# Altium schematic sheet Clocking.SchDoc: BaseBand Front-End
size A3; Revision: 1; SheetNumber: 5; ModifiedDate: 07.06.2011г
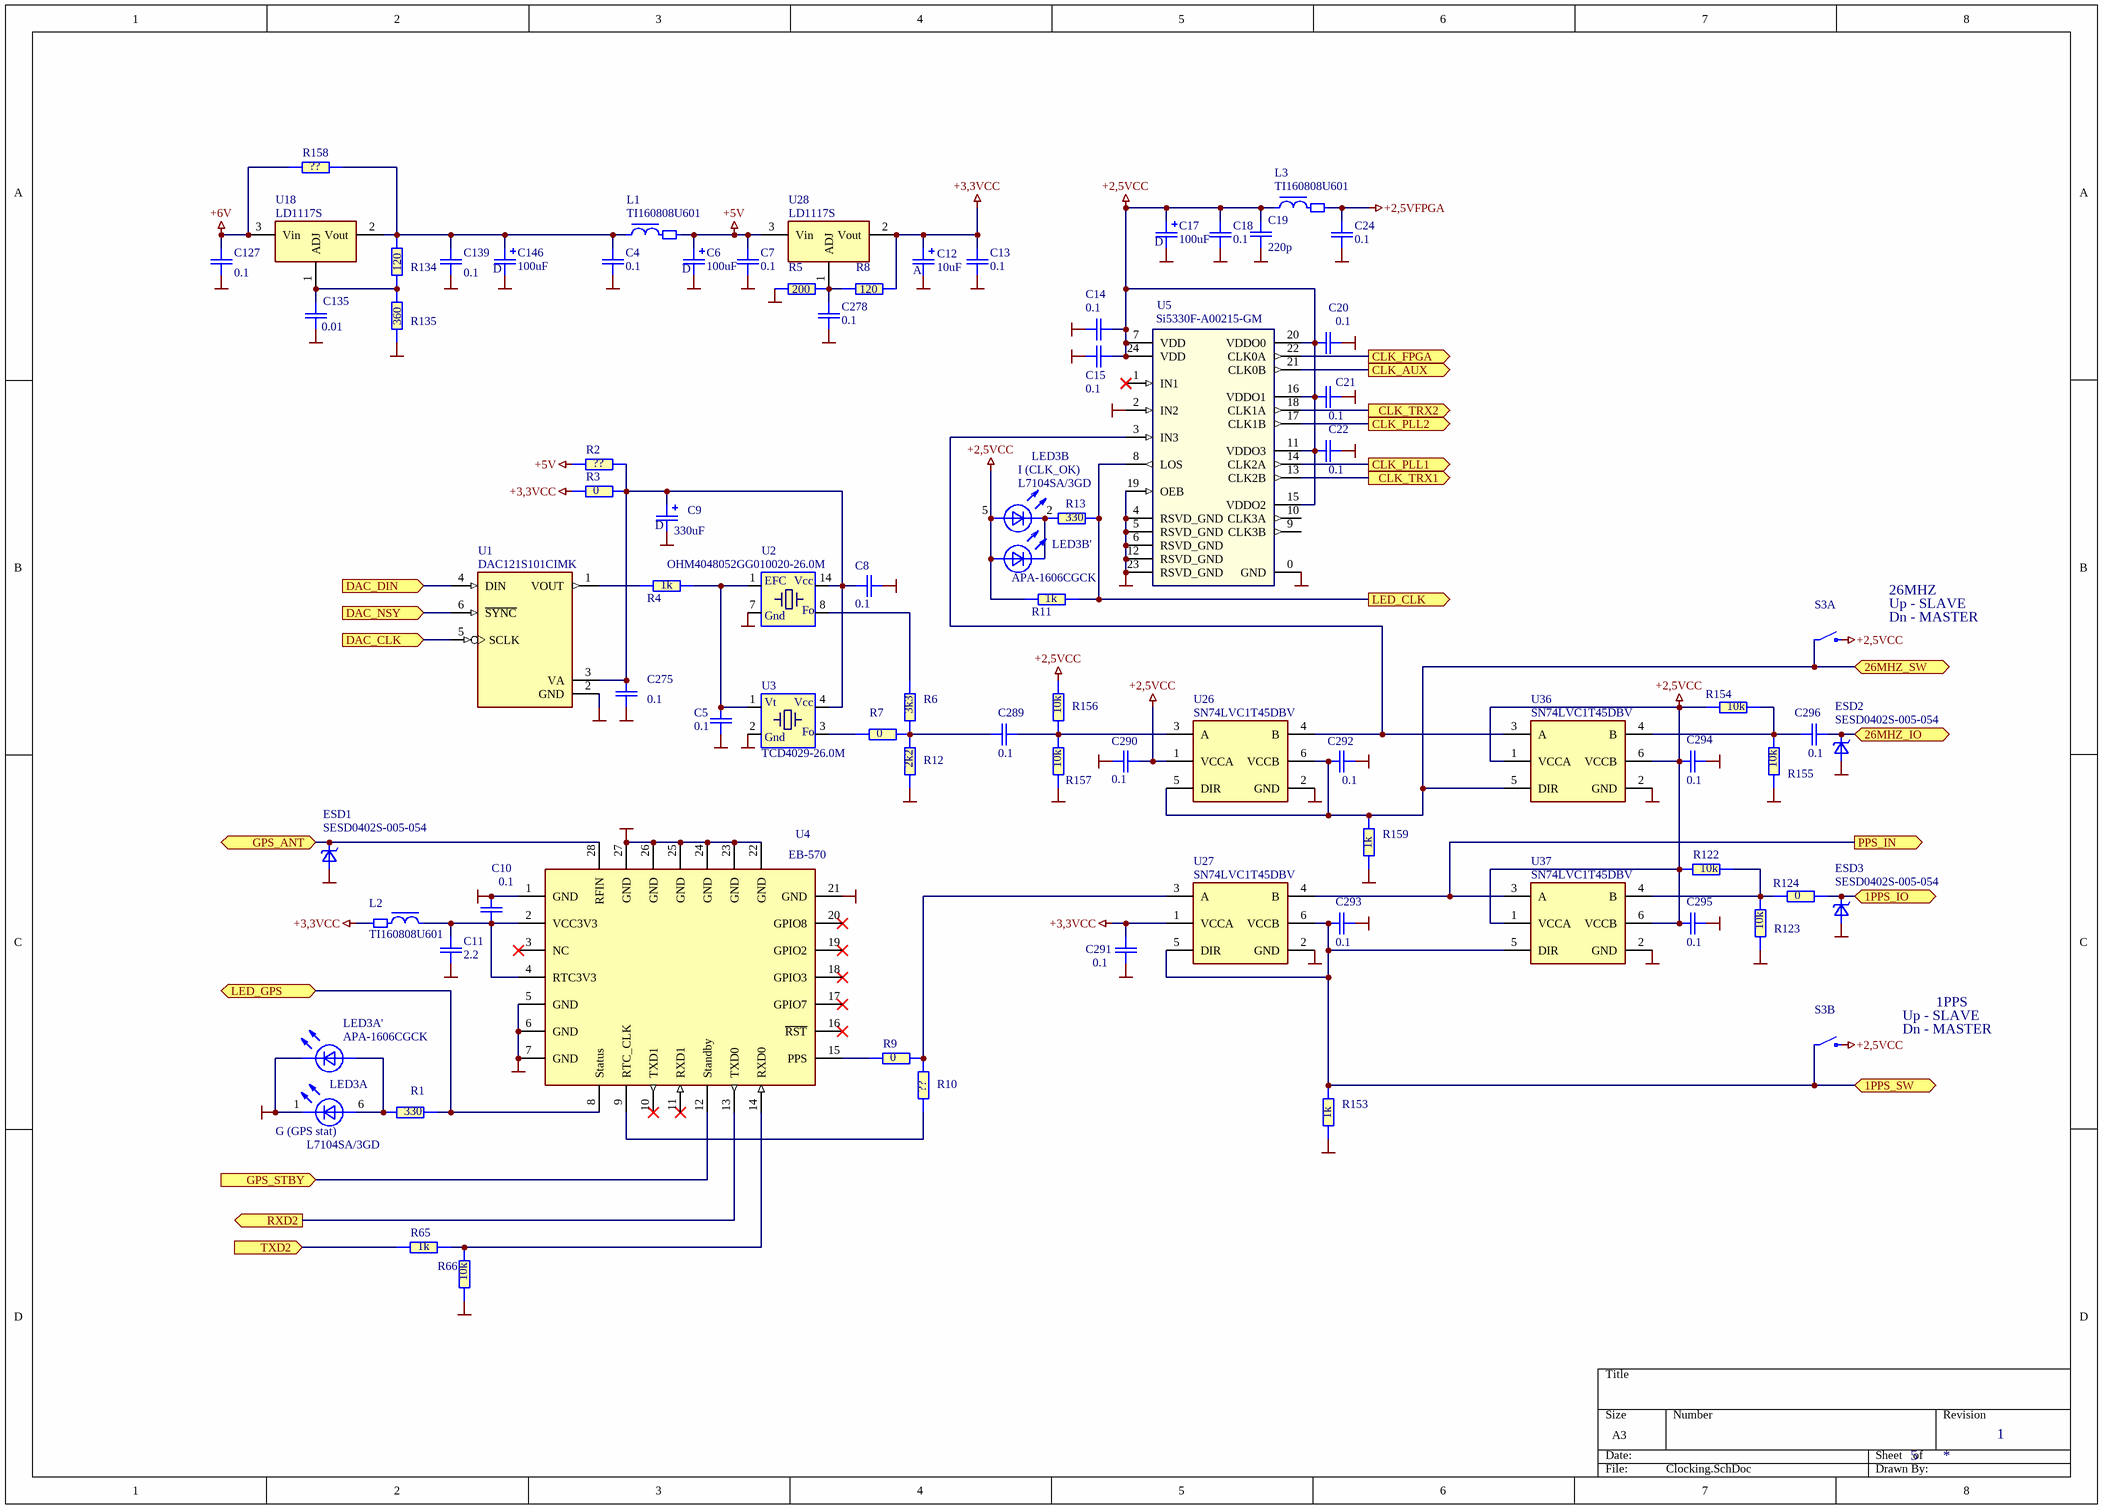
[diagram p0: Clocking.SchDoc]

## Parts
C4  0.1  [C0402-Phillips]
C5  0.1  [C0402-Phillips]
C6  100uF  [cd7343]
C7  0.1  [C0402-Phillips]
C8  0.1  [C0402-Phillips]
C9  330uF  [cd7343]
C10  0.1  [C0402-Phillips]
C11  2.2  [C0402-Phillips]
C12  10uF  [CA3216]
C13  0.1  [C0402-Phillips]
C14  0.1  [C0402-Phillips]
C15  0.1  [C0402-Phillips]
C17  100uF  [cd7343]
C18  0.1  [C0402-Phillips]
C19  220p  [C0603-PHILLIPS]
C20  0.1  [C0402-Phillips]
C21  0.1  [C0402-Phillips]
C22  0.1  [C0402-Phillips]
C24  0.1  [C0402-Phillips]
C127  0.1  [C0402-Phillips]
C135  0.01  [C0402-Phillips]
C139  0.1  [C0402-Phillips]
C146  100uF  [cd7343]
C275  0.1  [C0402-Phillips]
C278  0.1  [C0402-Phillips]
C289  0.1  [C0402-Phillips]
C290  0.1  [C0402-Phillips]
C291  0.1  [C0402-Phillips]
C292  0.1  [C0402-Phillips]
C293  0.1  [C0402-Phillips]
C294  0.1  [C0402-Phillips]
C295  0.1  [C0402-Phillips]
C296  0.1  [C0402-Phillips]
ESD1  SESD0402S-005-054  [SESD0402-Phillips]
ESD2  SESD0402S-005-054  [SESD0402-Phillips]
ESD3  SESD0402S-005-054  [SESD0402-Phillips]
L1  TI160808U601  [Ti160808-Phillips]
L2  TI160808U601  [Ti160808-Phillips]
L3  TI160808U601  [Ti160808-Phillips]
LED3  L7104SA/3GD  [L-7104SA/3]  (parts A,B of 3)
LED3A'  APA-1606CGCK  [KPA-1606g]
LED3B'  APA-1606CGCK  [KPA-1606g]
R1  330  [R0603-PHILLIPS]
R2  ??  [R0603-PHILLIPS]
R3  0  [R0603-PHILLIPS]
R4  1k  [R0603-PHILLIPS]
R5  200  [R0603-PHILLIPS]
R6  3k3  [R0603-PHILLIPS]
R7  0  [R0603-PHILLIPS]
R8  120  [R0603-PHILLIPS]
R9  0  [R0603-PHILLIPS]
R10  ??  [R0603-PHILLIPS]
R11  1k  [R0603-PHILLIPS]
R12  2k2  [R0603-PHILLIPS]
R13  330  [R0603-PHILLIPS]
R65  1k  [R0603-PHILLIPS]
R66  10k  [R0603-PHILLIPS]
R122  10k  [R0603-PHILLIPS]
R123  10k  [R0603-PHILLIPS]
R124  0  [R0603-PHILLIPS]
R134  120  [R0603-PHILLIPS]
R135  360  [R0603-PHILLIPS]
R153  1k  [R0603-PHILLIPS]
R154  10k  [R0603-PHILLIPS]
R155  10k  [R0603-PHILLIPS]
R156  10k  [R0603-PHILLIPS]
R157  10k  [R0603-PHILLIPS]
R158  ??  [R0603-PHILLIPS]
R159  1k  [R0603-PHILLIPS]
S3  CHP-021A  [CHP-02xA]  (value not drawn)  (parts A,B of 2)
U1  DAC121S101CIMK  [SOT-23-6]
U2  OHM4048052GG010020-26.0M  [DIL14-20x13,2]
U3  TCD4029-26.0M  [TCXO5X3]
U4  EB-570  [EB-570]
U5  Si5330F-A00215-GM  [QFN-24(4x4/0/5mm) with Pad]
U18  LD1117S  [SOT-223-1]
U26  SN74LVC1T45DBV  [SOT-23-6-min]
U27  SN74LVC1T45DBV  [SOT-23-6-min]
U28  LD1117S  [SOT-223-1]
U36  SN74LVC1T45DBV  [SOT-23-6-min]
U37  SN74LVC1T45DBV  [SOT-23-6-min]

## Ports
1PPS_IO, 1PPS_SW, 26MHZ_IO, 26MHZ_SW, CLK_AUX (out), CLK_FPGA (out), CLK_PLL1 (out), CLK_PLL2 (out), CLK_TRX1 (out), CLK_TRX2 (out), DAC_CLK (in), DAC_DIN (in), DAC_NSY (in), GPS_ANT, GPS_STBY (in), LED_CLK (out), LED_GPS, PPS_IN (out), RXD2 (out), TXD2 (in)

## Nets
+2,5VCC: C14.2 C15.2 C17.1(+) C18.1 C19.1 C20.1 C21.1 C22.1 C290.1 C294.2 C295.2 L3.1 LED3.5(A2) LED3B'.2(A) R11.1 R122.2 R154.2 R156.1 S3.3 S3.4 U5.7(VDD) U5.11(VDDO3) U5.15(VDDO2) U5.16(VDDO1) U5.20(VDDO0) U5.24(VDD) U26.1(VCCA) U36.1(VCCA) U36.6(VCCB) U37.1(VCCA) U37.6(VCCB)
+2,5VFPGA: C24.1 L3.2
+3,3VCC: C12.1(+) C13.1 C291.1 L2.2 R3.1 R8.2 U27.1(VCCA) U28.2(Vout)
+5V: C6.1(+) C7.1 L1.2 R2.1 U28.3(Vin)
+6V: C127.1 R158.1 U18.3(Vin)
GND: C4.2 C5.1 C6.2(-) C7.2 C8.2 C9.2(-) C10.2 C11.2 C12.2(-) C13.2 C14.1 C15.1 C17.2(-) C18.2 C19.2 C20.2 C21.2 C22.2 C24.2 C127.2 C135.2 C139.2 C146.2(-) C275.1 C278.2 C290.2 C291.2 C292.1 C293.1 C294.1 C295.1 ESD1.2(A) ESD2.2(A) ESD3.2(A) LED3.1(K1) LED3A'.1(K) R5.1 R12.1 R66.1 R123.2 R135.2 R153.1 R155.2 R157.2 R159.1 U1.2(GND) U2.7(GND) U3.2(GND) U4.1(GND) U4.5(GND) U4.6(GND) U4.7(GND) U4.21(GND) U4.22(GND) U4.23(GND) U4.24(GND) U4.25(GND) U4.26(GND) U4.27(GND) U5.0(GND) U5.2(IN2) U5.4(RSVD_GND) U5.5(RSVD_GND) U5.6(RSVD_GND) U5.12(RSVD_GND) U5.19(OEB) U5.23(RSVD_GND) U26.2(GND) U27.2(GND) U36.2(GND) U37.2(GND)
1PPS_IO: ESD3.1(K) R124.1 ; port 1PPS_IO
1PPS_SW: C293.2 R153.2 S3.2 U27.5(DIR) U27.6(VCCB) U37.5(DIR) ; port 1PPS_SW
26MHZ_IO: C296.1 ESD2.1(K) ; port 26MHZ_IO
26MHZ_SW: C292.2 R159.2 S3.1 U26.5(DIR) U26.6(VCCB) U36.5(DIR) ; port 26MHZ_SW
CLK_AUX: U5.21(CLK0B) ; port CLK_AUX
CLK_FPGA: U5.22(CLK0A) ; port CLK_FPGA
CLK_PLL1: U5.14(CLK2A) ; port CLK_PLL1
CLK_PLL2: U5.17(CLK1B) ; port CLK_PLL2
CLK_TRX1: U5.13(CLK2B) ; port CLK_TRX1
CLK_TRX2: U5.18(CLK1A) ; port CLK_TRX2
DAC_CLK: U1.5(SCLK) ; port DAC_CLK
DAC_DIN: U1.4(DIN) ; port DAC_DIN
DAC_NSY: U1.6(~{SYNC}) ; port DAC_NSY
GPS_ANT: ESD1.1(K) U4.28(RFIN) ; port GPS_ANT
GPS_STBY: U4.12(Standby) ; port GPS_STBY
LED_CLK: R11.2 R13.2 U5.8(LOS) ; port LED_CLK
LED_GPS: R1.2 U4.8(Status) ; port LED_GPS
PPS_IN: U27.4(B) U37.3(A) ; port PPS_IN
RXD2: U4.13(TXD0) ; port RXD2
TXD2: R65.1 ; port TXD2
NetC4_1: C4.1 C139.1 C146.1(+) L1.1 R134.1 R158.2 U18.2(Vout)
NetC5_2: C5.2 R4.2 U2.1(EFC) U3.1(Vtune)
NetC8_1: C8.1 C9.1(+) C275.2 R2.2 R3.2 U1.3(VA) U2.14(VCC) U3.4(VCC)
NetC10_1: C10.1 C11.1 L2.1 U4.2(VCC3V3) U4.4(RTC3V3)
NetC135_1: C135.1 R134.2 R135.1 U18.1(ADJ)
NetC278_1: C278.1 R5.2 R8.1 U28.1(ADJ)
NetC289_1: C289.1 R156.2 R157.1 U26.3(A)
NetC289_2: C289.2 R6.2 R7.2 R12.2
NetC296_2: C296.2 R154.1 R155.1 U36.4(B)
NetLED3_2: LED3.2(K2) LED3B'.1(K) R13.1
NetLED3_6: LED3.6(A1) LED3A'.2(A) R1.1
NetR4_1: R4.1 U1.1(VOUT)
NetR6_1: R6.1 U2.8(Fo)
NetR7_1: R7.1 U3.3(Fo)
NetR9_1: R9.1 U4.15(PPS)
NetR9_2: R9.2 R10.2 U27.3(A)
NetR10_1: R10.1 U4.9(RTC_CLK)
NetR65_2: R65.2 R66.2 U4.14(RXD0)
NetR122_1: R122.1 R123.1 R124.2 U37.4(B)
NetU5_3: U5.3(IN3) U26.4(B) U36.3(A)

Not connected (* = marked no-connect by the designer): U4 3(NC)* 10(TXD1)* 11(RXD1)* 16(~{RST})* 17(GPIO7)* 18(GPIO3)* 19(GPIO2)* 20(GPIO8)*; U5 1(IN1)* 9(CLK3B) 10(CLK3A)

## Notes on the sheet
- I (CLK_OK)
- (near S3) Dn - MASTER
- Up - SLAVE
- 26MHZ
- Dn - MASTER
- 1PPS
- (near LED3) G (GPS stat)
- (in symbol CA3216) A
- (in symbol CD7343) D
- (in symbol OCVCXO) Vcc; Gnd
- (in symbol TCVCXO_5X3) Vt; Vcc; Gnd

## Library data of the parts
C4 C5 C7 C8 C10 C11 C13-C15 C18 C20-C22 C24 C127 C135 C139 C275 C278 C289-C296 = C0402: Конденсатор; Manufacturer: MURATA; Tolerance: 20%; Name: SMD0402; U/P/TKE: Y5V
  C4 C5 C7 C8 C10 C13-C15 C18 C20-C22 C24 C127 C139 C275 C278 C289-C296: Value: 0.1
  C11: Value: 2.2
  C135: Value: 0.01
C6 C17 C146 = CD7343: Конденсатор; Manufacturer: SPRAGUE; Name: CASE-G; U/P/TKE: 16V; Value: 100uF
C9 = CD7343: Конденсатор; Manufacturer: Kemet; Name: CASE-D; U/P/TKE: 10V; Value: 330uF
C12 = CA3216: Конденсатор; Manufacturer: SPRAGUE; Name: Case A; U/P/TKE: 10V; Value: 10uF
C19 = C0603: Конденсатор; Manufacturer: MURATA; Tolerance: 20%; Name: SMD0603; U/P/TKE: NP0; Value: 220p
ESD1-ESD3 = SESD0402S: ESD diod unidirectional; Manufacturer: Tyco Electronics Corp; U/P/TKE: 5.4V; Name: SESD0402S-005-054
L1-L3 = TI160808: Дроссель ЭМС; Manufacturer: MURATA; Name: TI160808U601; Value: *
LED3 = L7104SA/3: Светодиод; Manufacturer: KINGBRIGTH; PDF: d:\Proj\Components\Kingbright\L-7104SA-3GD(Ver.4).pdf; Name: L7104SA/3GD
LED3A' LED3B' = KPA-1606: Светодиод; Manufacturer: Kingbright; Name: APA-1606CGCK
R1-R13 R65 R66 R122-R124 R134 R135 R153-R159 = R0603: Резистор; Manufacturer: YAGEO; Tolerance: 5%; Name: SMD0603; U/P/TKE: 0.1W
  R1 R13: Value: 330
  R2 R10 R158: Value: ??
  R3 R7 R9 R124: Value: 0
  R4 R11 R65 R153 R159: Value: 1k
  R5: Value: 200
  R6: Value: 3k3
  R8 R134: Value: 120
  R12: Value: 2k2
  R66 R122 R123 R154-R157: Value: 10k
  R135: Value: 360
S3 = CHP-021A: Switch 2pos Piano SMD right angle; Manufacturer: Copal Electronics; Name: CHP-021A; Misc: *
U1 = DAC121S101CIMK: Микросхема; Manufacturer: National Semiconductor; Misc: 12-Bit Micro Power Digital-to-Analog Converter with Rail-to-Rail Output; Supplier 1: Farnell; Supplier Part Number 1: 1101198; ComponentLink1Description: DAC121S101 Datasheet; ComponentLink1URL: http://www.national.com/ds/DA/DAC121S101.pdf; ComponentLink2Description: DAC121S101 Web Page; ComponentLink2URL: http://www.national.com/pf/DA/DAC121S101.html; ComponentLink3Description: MK06A Package Page; ComponentLink3URL: http://www.national.com/packaging/folders/mk06a.html; Name: DAC121S101CIMK
U2 = OCVCXO: Manufacturer: Pletronics; Misc: TCXO; Name: OHM4048052GG010020-26.0M
U3 = TCVCXO_5X3: TCVCXO; Manufacturer: Pletronics; Misc: TCXO; Name: TCD4029-26.0M
U4 = EB-570: Микросхема; Manufacturer: Transystem Inc.; Misc: GPS receiver module; Name: EB-570
U5 = SI5330: Микросхема; Manufacturer: Silicon Laboratoryes; Misc: CLOCK BUFFER/LEVEL TRANSLATOR; Swap: No; Name: Si5330F-A00215-GM
U18 U28 = LD1117ADJ: Микросхема; Manufacturer: STMicro; Swap: No; Name: LD1117S
U26 U27 U36 U37 = SN74LVC1T45DBV: Микросхема; Manufacturer: TI; Swap: No; Misc: Single-bit noninverting bus transceiver; PDF: d:\Proj\Components\Texas Instruments\SN74LVC1T45DBV.pdf; Name: SN74LVC1T45DBV